# EAGLE design VIM2-AccelController (EAGLE 9.6.2)
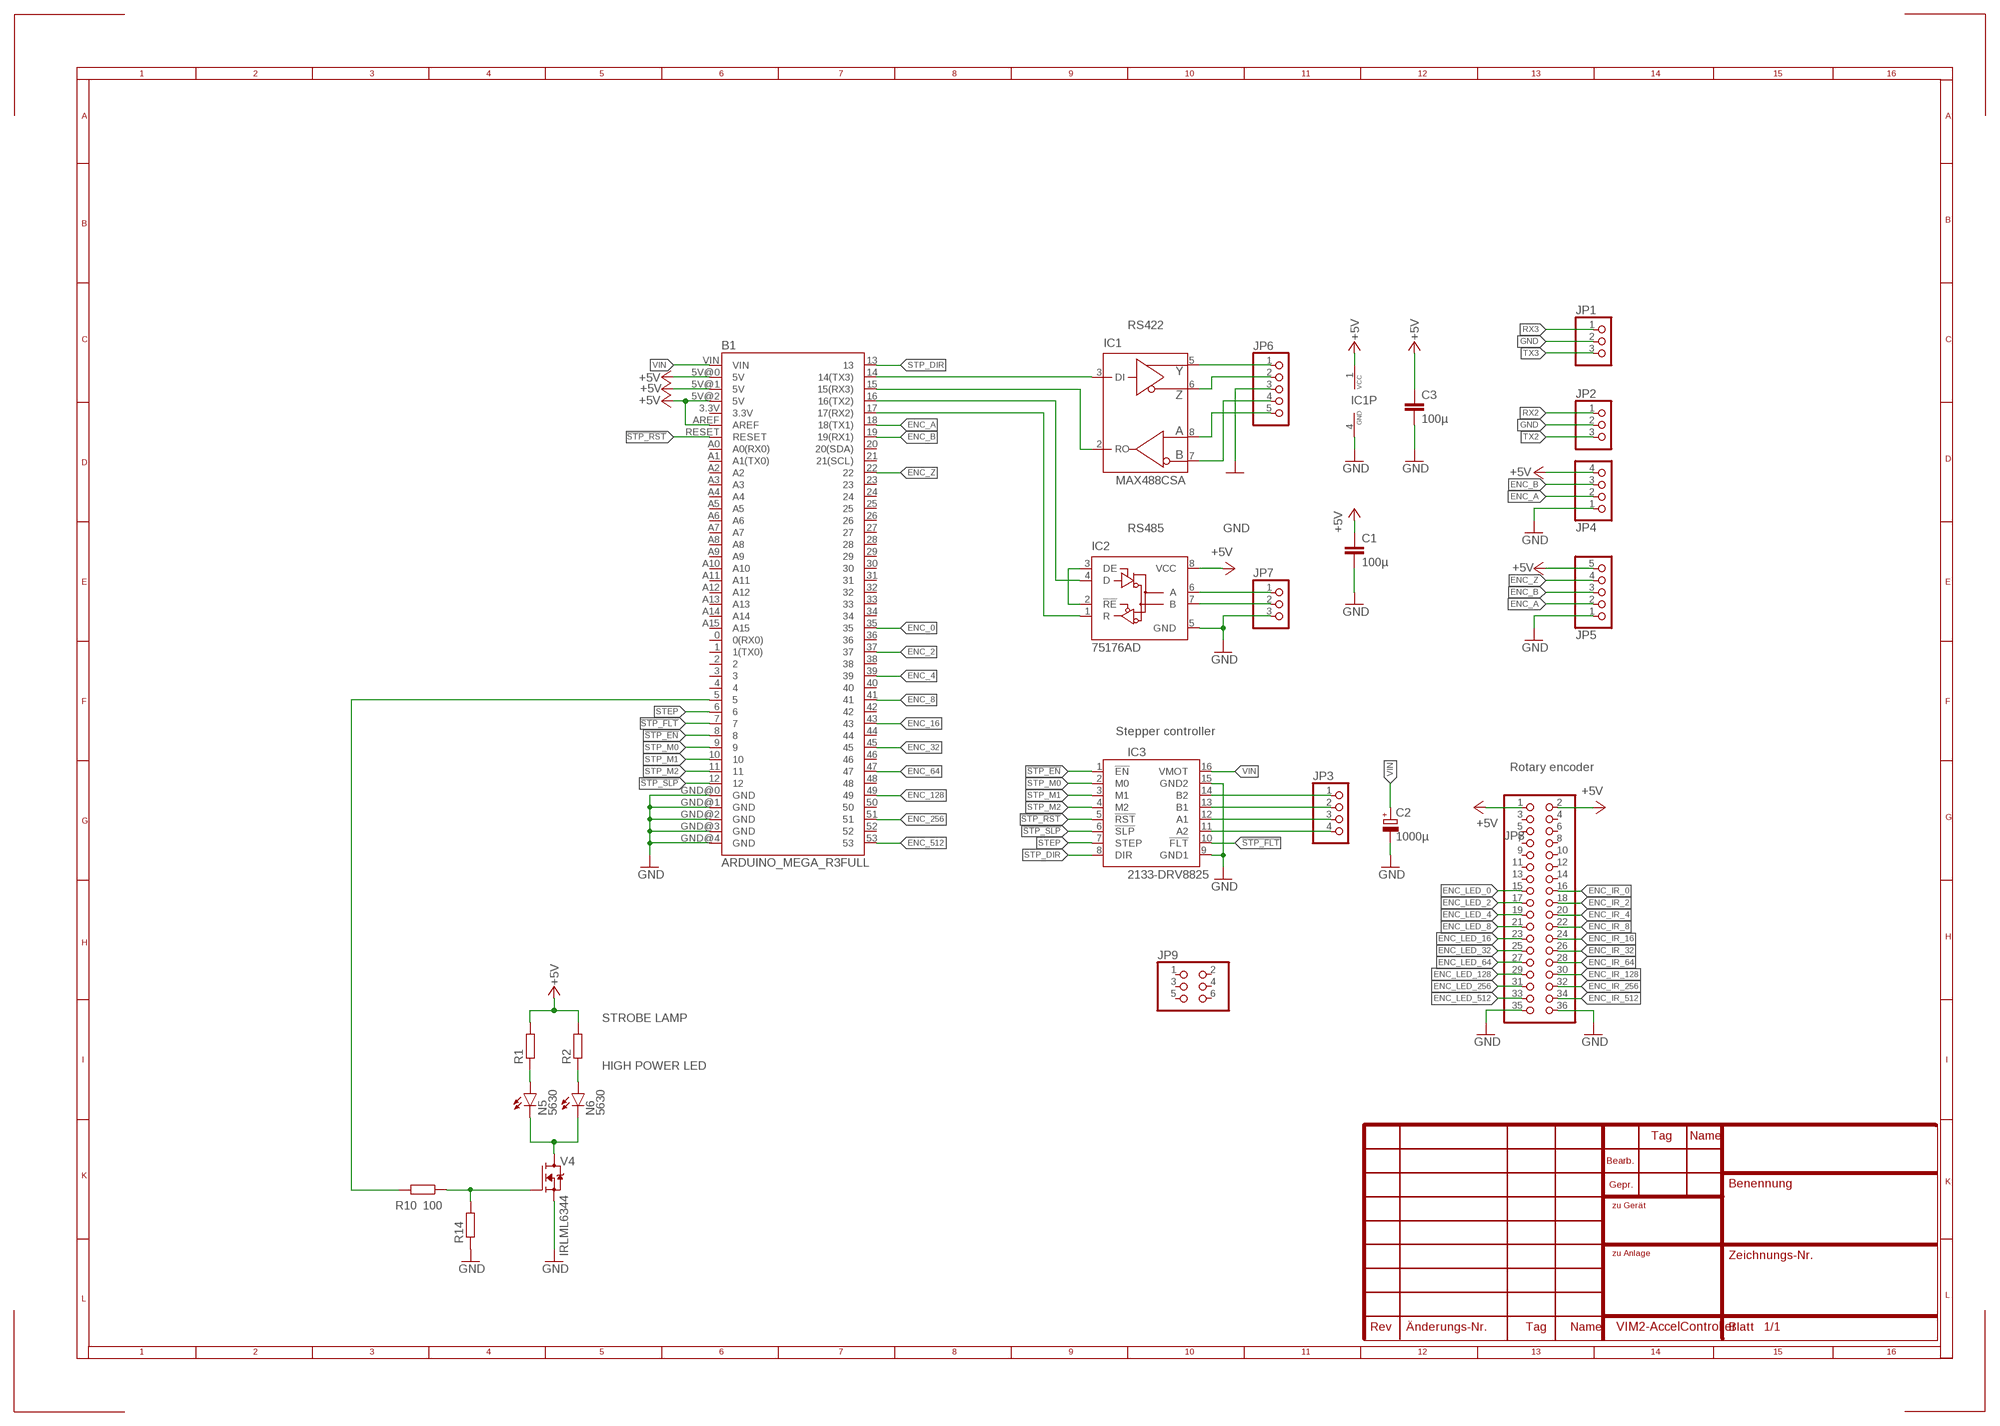
[diagram p0: schematic, sheet 1]

## Parts
B1  ARDUINO_MEGA_R3FULL  [ARDUINO_MEGA]
C1  100µ  C-EUC0805K  [C0805K]
C2  1000µ  CPOL-EUE5-8.5  [E5-8,5]
C3  100µ  C-EUC0805K  [C0805K]
IC1  MAX488CSA  [SO08]
IC2  75176AD  [D_R-PDSO-G8]
IC3  2133-DRV8825  [DRV8825]
JP1  PINHD-1X3  [1X03]
JP2  PINHD-1X3  [1X03]
JP3  PINHD-1X4/90  [1X04/90]
JP4  PINHD-1X4  [1X04]
JP5  PINHD-1X5  [1X05]
JP6  PINHD-1X5  [1X05]
JP7  PINHD-1X3  [1X03]
JP8  PINHD-2X18  [2X18]
JP9  PINHD-2X3  [2X03]
N5  5630  [5730]
N6  5630  [5730]
R1  100  R-EU_R0805  [R0805]
R2  100  R-EU_R0805  [R0805]
R10  100  R-EU_R0805  [R0805]
R14  4k7  R-EU_R0805  [R0805]
V4  IRLML6344  [SOT23]

## Nets
!STP_EN: B1.8 IC3.1(!EN)
!STP_FLT: B1.7 IC3.10(!FLT)
!STP_RST: B1.RESET IC3.5(!RST)
!STP_SLP: B1.12 IC3.6(!SLP)
+5V: B1.5V@0(5V) B1.5V@1(5V) B1.5V@2(5V) B1.AREF C1.1 C3.1 IC1.1(VCC) IC2.8(VCC) JP4.4 JP5.5 JP8.1 JP8.2 R1.2 R2.2
A: IC1.8(A) JP6.5
B: IC1.7(B) JP6.4
ENC_0: B1.35
ENC_2: B1.37
ENC_4: B1.39
ENC_8: B1.41
ENC_16: B1.43
ENC_32: B1.45
ENC_64: B1.47
ENC_128: B1.49
ENC_256: B1.51
ENC_512: B1.53
ENC_A: B1.18(18(TX1)) JP4.2 JP5.2
ENC_B: B1.19(19(RX1)) JP4.3 JP5.3
ENC_IR_0: JP8.16
ENC_IR_2: JP8.18
ENC_IR_4: JP8.20
ENC_IR_8: JP8.22
ENC_IR_16: JP8.24
ENC_IR_32: JP8.26
ENC_IR_64: JP8.28
ENC_IR_128: JP8.30
ENC_IR_256: JP8.32
ENC_IR_512: JP8.34
ENC_LED_0: JP8.15
ENC_LED_2: JP8.17
ENC_LED_4: JP8.19
ENC_LED_8: JP8.21
ENC_LED_16: JP8.23
ENC_LED_32: JP8.25
ENC_LED_64: JP8.27
ENC_LED_128: JP8.29
ENC_LED_256: JP8.31
ENC_LED_512: JP8.33
ENC_Z: B1.22 JP5.4
GND: B1.GND@0(GND) B1.GND@1(GND) B1.GND@2(GND) B1.GND@3(GND) B1.GND@4(GND) C1.2 C2.- C3.2 IC1.4(GND) IC2.5(GND) IC3.9(GND1) IC3.15(GND2) JP1.2 JP2.2 JP4.1 JP5.1 JP6.3 JP7.3 JP8.35 JP8.36 R14.1 V4.2(S)
N$2: N5.P$1(A) N5.P$2(A) R1.1
N$3: IC2.2(!RE) IC2.3(DE)
N$4: N5.P$3(C) N6.P$3(C) V4.3(D)
N$5: R10.1 R14.2 V4.1(G)
N$6: IC2.6(A) JP7.1
N$7: IC2.7(B) JP7.2
N$8: IC3.14(B2) JP3.1
N$9: IC3.13(B1) JP3.2
N$10: IC3.12(A1) JP3.3
N$11: IC3.11(A2) JP3.4
N$12: N6.P$1(A) N6.P$2(A) R2.1
RX2: B1.17(17(RX2)) IC2.1(R) JP2.1
RX3: B1.15(15(RX3)) IC1.2(RO) JP1.1
STEP: B1.6 IC3.7(STEP)
STP_DIR: B1.13 IC3.8(DIR)
STP_M0: B1.9 IC3.2(M0)
STP_M1: B1.10 IC3.3(M1)
STP_M2: B1.11 IC3.4(M2)
TX2: B1.16(16(TX2)) IC2.4(D) JP2.3
TX3: B1.14(14(TX3)) IC1.3(DI) JP1.3
VIN: B1.VIN C2.+ IC3.16(VMOT)
WH: B1.5 R10.2
Y: IC1.5(Y) JP6.1
Z: IC1.6(Z) JP6.2
Unconnected: B1.0(0(RX0)) B1.1(1(TX0)) B1.2 B1.3 B1.3.3V B1.4 B1.20(20(SDA)) B1.21(21(SCL)) B1.23 B1.24 B1.25 B1.26 B1.27 B1.28 B1.29 B1.30 B1.31 B1.32 B1.33 B1.34 B1.36 B1.38 B1.40 B1.42 B1.44 B1.46 B1.48 B1.50 B1.52 B1.A0(A0(RX0)) B1.A1(A1(TX0)) B1.A2 B1.A3 B1.A4 B1.A5 B1.A6 B1.A7 B1.A8 B1.A9 B1.A10 B1.A11 B1.A12 B1.A13 B1.A14 B1.A15 JP8.3 JP8.4 JP8.5 JP8.6 JP8.7 JP8.8 JP8.9 JP8.10 JP8.11 JP8.12 JP8.13 JP8.14 JP9.1 JP9.2 JP9.3 JP9.4 JP9.5 JP9.6

## Notes on the sheet
- RS422
- RS485
- Stepper controller
- Rotary encoder
- STROBE LAMP
- HIGH POWER LED

## Library data of the parts
B1 = SparkFun-Boards:ARDUINO_MEGA_R3: Arduino Mega R3 ATmega2560 R3 compatible footprint. SparkFun Products: Arduino Mega 2560 R3 <https://www.sparkfun.com/products/11061>
C1 C3 = rcl:C-EU: CAPACITOR, European symbol; SPICEPREFIX: C
C2 = rcl:CPOL-EU: POLARIZED CAPACITOR, European symbol; SPICEPREFIX: C
IC1 = maxim:MAX488: RS485 TRANSEIVER Source: Data sheet <http://datasheets.maxim-ic.com/en/ds/MAX1487-MAX491.pdf>; MF: MAXIM; MPN: MAX488CSA; OC_FARNELL: 3534170; OC_NEWARK: 34C3921
IC2 = 751xx:75176A: DIFFERENTIAL BUS TRANSCEIVER Source: http://focus.ti.com/lit/ds/symlink/sn75176a.pdf
IC3 = pololu-stepper-driver:2133-DRV8825: DRV8825 Stepper Motor Driver Carrier, High Current #2133 DRV8825 Stepper Motor Driver Carrier; High Current <https://www.pololu.com/product/2133> in Japan, Suzaku Lab. Ltd. <https://suzakugiken.jp/> #2133 DRV8825 大電流用ステッピングモータドライバ <https://szc.jp/po2133>
JP1 JP2 JP7 = pinhead:PINHD-1X3: PIN HEADER
JP3 JP4 = pinhead:PINHD-1X4: PIN HEADER
JP5 JP6 = pinhead:PINHD-1X5: PIN HEADER
JP8 = pinhead:PINHD-2X18: PIN HEADER
JP9 = pinhead:PINHD-2X3: PIN HEADER
N5 N6 = led:5630
R1 R2 R10 R14 = rcl:R-EU_: RESISTOR, European symbol
V4 = transistor-fet:IRLML6344

## Board
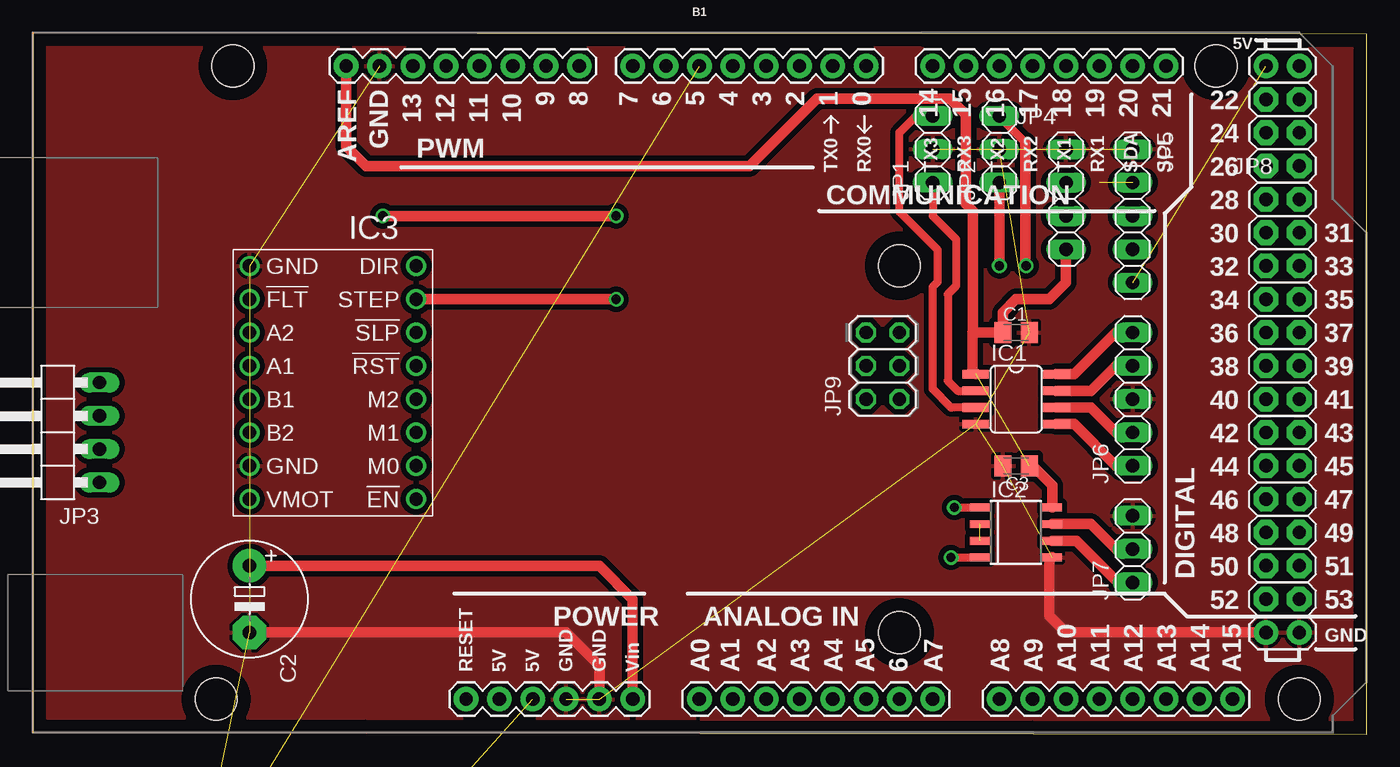
[diagram p1: board, top side]
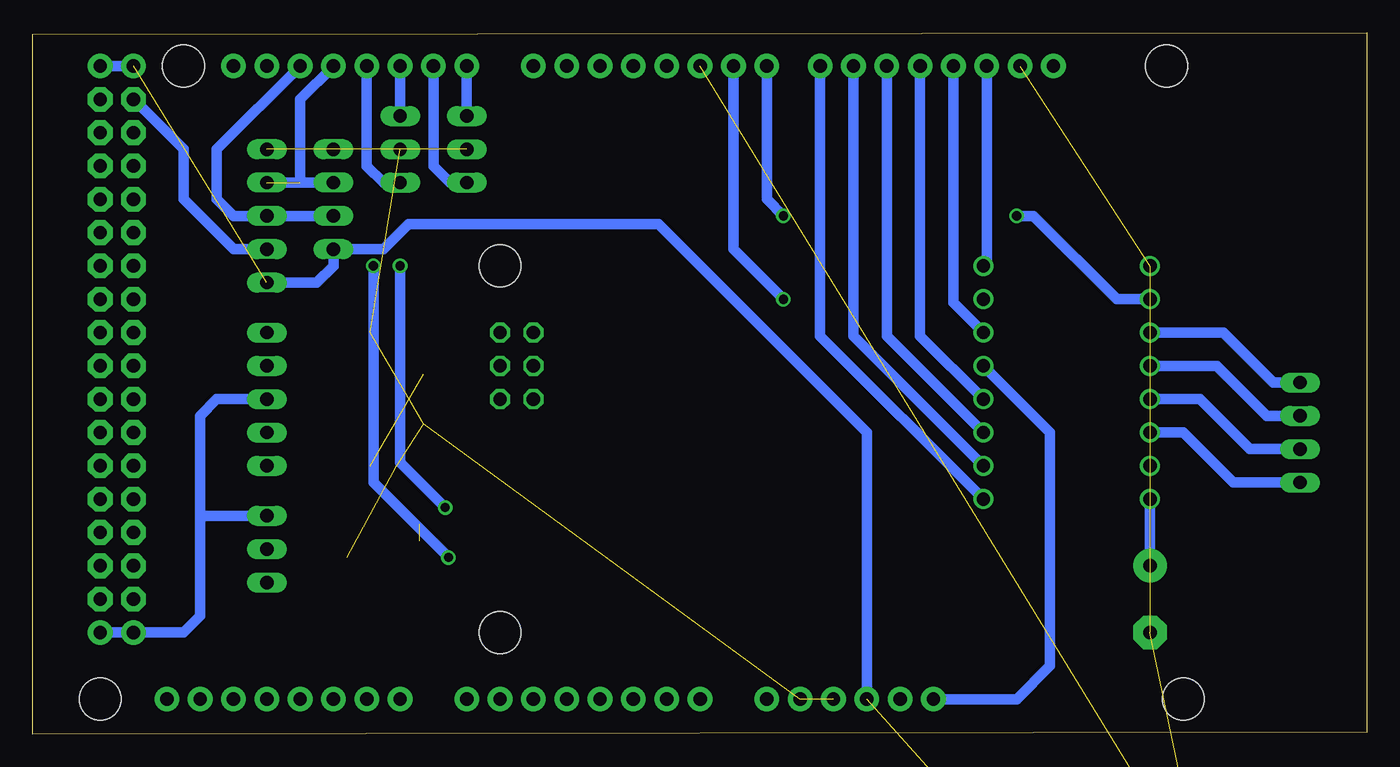
[diagram p2: board, bottom side, seen from below]

Size 101.65 x 53.46 mm. Coordinates in mm from the lower left corner, seen from the top.
Outline: 0,0.13 101.65,0 101.65,53.33 0,53.46 0,0.13
Copper layers (1*16): Top 0.035mm / dielectric 1.5mm / Bottom 0.035mm
Design rules "default": minimum track width 6mil, minimum drill 0.35mm, track to track 6mil, track to pad 6mil, pad to pad 6mil, via to via 6mil, smd to smd 6mil, copper to edge 40mil, drill to drill 6mil, minimum pad ring 10mil, minimum via ring 8mil, stop-mask expansion 4mil, vias tented up to drill 0mil, thermal gap 10mil

### Footprints (pad centres in the part's own frame; a part is rotated, then mirrored left to right if it is on the bottom)
ARDUINO_MEGA = drill 1.016 pad 1.88: 0 13.97,24.13; 1 11.43,24.13; 2 8.89,24.13; 3 6.35,24.13; 3.3V -13.97,-24.13; 4 3.81,24.13; 5 1.27,24.13; 5V@0 -11.43,-24.13; 5V@1 44.45,24.13; 5V@2 46.99,24.13; 6 -1.27,24.13; 7 -3.81,24.13; 8 -7.874,24.13; 9 -10.414,24.13; 10 -12.954,24.13; 11 -15.494,24.13; 12 -18.034,24.13; 13 -20.574,24.13; 14 19.05,24.13; 15 21.59,24.13; 16 24.13,24.13; 17 26.67,24.13; 18 29.21,24.13; 19 31.75,24.13; 20 34.29,24.13; 21 36.83,24.13; A0 1.27,-24.13; A1 3.81,-24.13; A2 6.35,-24.13; A3 8.89,-24.13; A4 11.43,-24.13; A5 13.97,-24.13; A6 16.51,-24.13; A7 19.05,-24.13; A8 24.13,-24.13; A9 26.67,-24.13; A10 29.21,-24.13; A11 31.75,-24.13; A12 34.29,-24.13; A13 36.83,-24.13; A14 39.37,-24.13; A15 41.91,-24.13; AREF -25.654,24.13; GND@0 -8.89,-24.13; GND@1 -6.35,-24.13; GND@2 44.45,-19.05; GND@3 46.99,-19.05; GND@4 -23.114,24.13; RESET -16.51,-24.13; VIN -3.81,-24.13 | drill 1.016 pad 1.88 octagon: 22 44.45,21.59; 23 46.99,21.59; 24 44.45,19.05; 25 46.99,19.05; 26 44.45,16.51; 27 46.99,16.51; 28 44.45,13.97; 29 46.99,13.97; 30 44.45,11.43; 31 46.99,11.43; 32 44.45,8.89; 33 46.99,8.89; 34 44.45,6.35; 35 46.99,6.35; 36 44.45,3.81; 37 46.99,3.81; 38 44.45,1.27; 39 46.99,1.27; 40 44.45,-1.27; 41 46.99,-1.27; 42 44.45,-3.81; 43 46.99,-3.81; 44 44.45,-6.35; 45 46.99,-6.35; 46 44.45,-8.89; 47 46.99,-8.89; 48 44.45,-11.43; 49 46.99,-11.43; 50 44.45,-13.97; 51 46.99,-13.97; 52 44.45,-16.51; 53 46.99,-16.51 | hole 3.2: -34.29,24.13; -35.56,-24.13; 16.51,8.89; 16.51,-19.05; 40.64,24.13; 46.99,-24.13
C0805K = smd 1.3 x 1.6: 1 -1,0; 2 1,0
E5-8,5 = drill 1.016 pad 2.54: + -2.54,0 | drill 1.016 pad 2.54 octagon: - 2.54,0
SO08 = smd 0.66 x 2.032: 1 -1.905,-3.073; 2 -0.635,-3.073; 3 0.635,-3.073; 4 1.905,-3.073; 5 1.905,3.073; 6 0.635,3.073; 7 -0.635,3.073; 8 -1.905,3.073
D_R-PDSO-G8 = smd 0.6 x 1.5: 1 -1.905,-2.75; 2 -0.635,-2.75; 3 0.635,-2.75; 4 1.905,-2.75; 5 1.905,2.75; 6 0.635,2.75; 7 -0.635,2.75; 8 -1.905,2.75
DRV8825 = drill 1.016: 1 -6.35,8.89; 2 -6.35,6.35; 3 -6.35,3.81; 4 -6.35,1.27; 5 -6.35,-1.27; 6 -6.35,-3.81; 7 -6.35,-6.35; 8 -6.35,-8.89; 9 6.35,-8.89; 10 6.35,-6.35; 11 6.35,-3.81; 12 6.35,-1.27; 13 6.35,1.27; 14 6.35,3.81; 15 6.35,6.35; 16 6.35,8.89
1X03 = drill 1.016 long: 1 -2.54,0; 2 0,0; 3 2.54,0
1X04/90 = drill 1.016 long: 1 -3.81,-3.81; 2 -1.27,-3.81; 3 1.27,-3.81; 4 3.81,-3.81
1X04 = drill 1.016 long: 1 -3.81,0; 2 -1.27,0; 3 1.27,0; 4 3.81,0
1X05 = drill 1.016 long: 1 -5.08,0; 2 -2.54,0; 3 0,0; 4 2.54,0; 5 5.08,0
2X18 = drill 1.016 octagon: 1 -21.59,-1.27; 2 -21.59,1.27; 3 -19.05,-1.27; 4 -19.05,1.27; 5 -16.51,-1.27; 6 -16.51,1.27; 7 -13.97,-1.27; 8 -13.97,1.27; 9 -11.43,-1.27; 10 -11.43,1.27; 11 -8.89,-1.27; 12 -8.89,1.27; 13 -6.35,-1.27; 14 -6.35,1.27; 15 -3.81,-1.27; 16 -3.81,1.27; 17 -1.27,-1.27; 18 -1.27,1.27; 19 1.27,-1.27; 20 1.27,1.27; 21 3.81,-1.27; 22 3.81,1.27; 23 6.35,-1.27; 24 6.35,1.27; 25 8.89,-1.27; 26 8.89,1.27; 27 11.43,-1.27; 28 11.43,1.27; 29 13.97,-1.27; 30 13.97,1.27; 31 16.51,-1.27; 32 16.51,1.27; 33 19.05,-1.27; 34 19.05,1.27; 35 21.59,-1.27; 36 21.59,1.27
2X03 = drill 1.016 octagon: 1 -2.54,-1.27; 2 -2.54,1.27; 3 0,-1.27; 4 0,1.27; 5 2.54,-1.27; 6 2.54,1.27
5730 = smd 1.016 x 1.778: P$1 -2.159,0; P$3 2.921,0 | smd 2.54 x 1.778: P$2 0,0
R0805 = smd 1.3 x 1.5: 1 -0.95,0; 2 0.95,0
SOT23 = smd 1 x 1.4: 1 -0.95,-1.1; 2 0.95,-1.1; 3 0,1.1

### Placement (x,y rotation side)
B1  49.53,26.8 0 top
C1  74.93,30.61 0 top
C2  16.51,10.29 270 top
C3  74.93,20.45 180 top
IC1  74.93,25.53 270 top
IC2  74.93,15.37 270 top
IC3  22.86,26.8 180 top
JP1  68.58,44.58 90 top
JP2  73.66,44.58 90 top
JP3  1.27,22.99 90 top
JP4  78.74,40.77 270 top
JP5  83.82,39.5 270 top
JP6  83.82,25.53 90 top
JP7  83.82,14.1 90 top
JP8  95.25,29.34 270 top
JP9  64.77,28.07 90 top
N5  -2.54,-6.22 0 top  (outside the outline)
N6  -2.54,-13.84 0 top  (outside the outline)
R1  -3.81,-43.05 0 top  (outside the outline)
R2  -3.81,-49.4 0 top  (outside the outline)
R10  -3.81,-36.7 0 top  (outside the outline)
R14  15.24,-36.7 0 top  (outside the outline)
V4  7.62,-29.08 0 top  (outside the outline)

### Tracks (layer width: path | path; a pad name or v marks a point on that pad's centre or on a via)
!STP_EN
  Bottom 0.813: B1.8 41.66,30.35 IC3.1
!STP_FLT  (via drill 0.7)
  Top 0.813: v44.45,39.5 v26.67,39.5
  Bottom 0.813: B1.7 45.72,40.77 v44.45,39.5 | v26.67,39.5 25.4,39.5 19.05,33.15 IC3.10
!STP_RST
  Bottom 0.813: IC3.5 24.13,22.99 24.13,5.21 26.67,2.67 B1.RESET
!STP_SLP
  Bottom 0.813: B1.12 31.5,32.89 IC3.6
+5V  (4 unrouted)
  Top 0.813: IC1.1 71.6,27.69 71.6,30.61 C1.1 | C3.1 76.2,20.45 77.68,18.97 IC2.8 | B1.AREF 23.88,44.83 25.4,43.31 54.61,43.31 59.74,48.44 69.89,48.44 71.12,47.21 71.12,40.39 71.63,39.88 71.63,30.61 C1.1 | JP4.4 78.74,34.42 77.47,33.15 74.93,33.15 73.93,32.15 C1.1
  Bottom 0.813: B1.5V@2 B1.5V@1 | JP5.5 80.01,34.42 78.74,35.69 JP4.4 74.93,36.96 73.03,38.86 53.98,38.86 38.1,22.99 B1.5V@0
A
  Top 0.813: JP6.5 82.55,30.61 79.38,27.43 IC1.8
B
  Top 0.813: JP6.4 82.55,28.07 80.64,26.16 IC1.7
ENC_A  (1 unrouted)
  Bottom 0.813: B1.18 81.28,48.39 81.28,42.04 | JP4.2 JP5.2
ENC_B
  Bottom 0.813: JP4.3 JP5.3 86.36,39.5 87.63,40.77 87.63,44.58 B1.19
ENC_Z
  Bottom 0.813: B1.22 90.17,44.58 90.17,40.77 86.36,36.96 JP5.4
GND  (14 unrouted)
  Top 0.813: JP8.35 78.74,7.75 77.47,9.02 77.47,13.25 IC2.5 | C2.- 40.64,7.75 43.18,5.21 B1.GND@1
  Bottom 0.813: JP8.36 JP8.35 90.17,7.75 88.9,9.02 88.9,16.64 | JP6.3 87.63,25.53 88.9,24.26 88.9,16.64 | JP7.3 88.9,16.64
  pour Top (isolate 0.406): -3.81,56.01 104.14,56.01 104.14,-2.41 -3.81,-2.41
N$2  (2 unrouted)
N$3  (1 unrouted)
N$4  (2 unrouted)
N$5  (2 unrouted)
N$6
  Top 0.813: IC2.6 79.52,14.73 82.69,11.56 JP7.1
N$7
  Top 0.813: JP7.2 82.55,14.1 80.64,16 IC2.7
N$8
  Bottom 0.813: IC3.14 13.97,22.99 10.16,19.18 JP3.1
N$9
  Bottom 0.813: IC3.13 12.7,25.53 8.89,21.72 JP3.2
N$10
  Bottom 0.813: IC3.12 11.43,28.07 7.62,24.26 JP3.3
N$11
  Bottom 0.813: IC3.11 10.92,30.61 7.11,26.8 JP3.4
N$12  (2 unrouted)
RX2  (via drill 0.7)
  Top 0.61: v70.23,17.27 IC2.1
  Top 0.813: JP2.1 v73.66,35.69
  Bottom 0.813: B1.17 76.2,43.31 74.93,42.04 JP2.1 | v73.66,35.69 73.66,20.7 v70.23,17.27
RX3
  Top 0.61: 68.58,41.87 JP1.1 68.58,39.5 70.36,37.72 70.36,34.16 69.72,33.53 69.72,26.92 70.48,26.16 IC1.2
  Bottom 0.813: B1.15 71.12,43.31 69.85,42.04 JP1.1
STEP  (via drill 0.7)
  Top 0.813: IC3.7 v44.45,33.15
  Bottom 0.813: v44.45,33.15 48.26,36.96 B1.6
STP_DIR
  Bottom 0.813: B1.13 28.96,35.94 IC3.8
STP_M0
  Bottom 0.813: B1.9 39.12,30.35 IC3.2
STP_M1
  Bottom 0.813: B1.10 36.58,30.35 IC3.3
STP_M2
  Bottom 0.813: B1.11 34.04,30.35 IC3.4
TX2  (via drill 0.7)
  Top 0.61: JP2.3 73.66,47.06 75.64,45.08 | 75.64,35.74 v75.69,35.69 | v69.98,13.46 IC2.4
  Top 0.813: 75.64,45.08 75.64,35.74
  Bottom 0.813: B1.16 JP2.3 | v75.69,35.69 75.69,19.18 v69.98,13.46
TX3
  Top 0.61: 68.53,47.17 JP1.3 67.31,47.12 66.04,45.85 66.04,39.82 68.96,36.9 68.96,34.48 68.58,34.1 68.58,26.29 69.98,24.89 IC1.3
  Bottom 0.813: B1.14 JP1.3
VIN
  Top 0.813: C2.+ 43.18,12.83 45.72,10.29 B1.VIN
  Bottom 0.813: C2.+ IC3.16
WH  (1 unrouted)
Y
  Top 0.813: JP6.1 82.55,20.45 79.38,23.62 IC1.5
Z
  Top 0.813: IC1.6 80.64,24.89 82.55,22.99 JP6.2